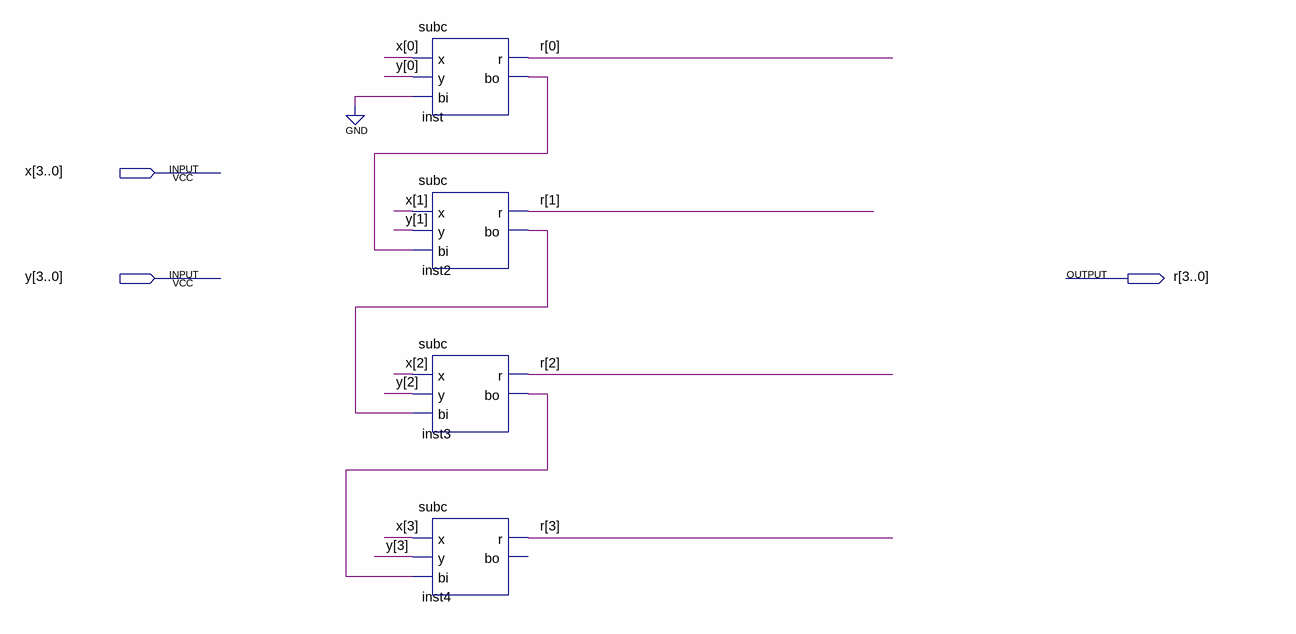
[diagram p0: schematic sheet]
// Quartus schematic subtrator.bdf as structural Verilog: 4 symbols, 3 pins
module subtrator (
  input  [3:0] x,
  input  [3:0] y,
  output [3:0] r
);

  wire inst2_bo, inst3_bo, inst_bo;

  subc inst (.x(x[0]), .y(y[0]), .bi(1'b0), .r(r[0]), .bo(inst_bo));
  subc inst2 (.x(x[1]), .y(y[1]), .bi(inst_bo), .r(r[1]), .bo(inst2_bo));
  subc inst3 (.x(x[2]), .y(y[2]), .bi(inst2_bo), .r(r[2]), .bo(inst3_bo));
  subc inst4 (.x(x[3]), .y(y[3]), .bi(inst3_bo), .r(r[3]));  // open: bo
endmodule
